# EAGLE design PulseFit-Mini (EAGLE 7.3.0)
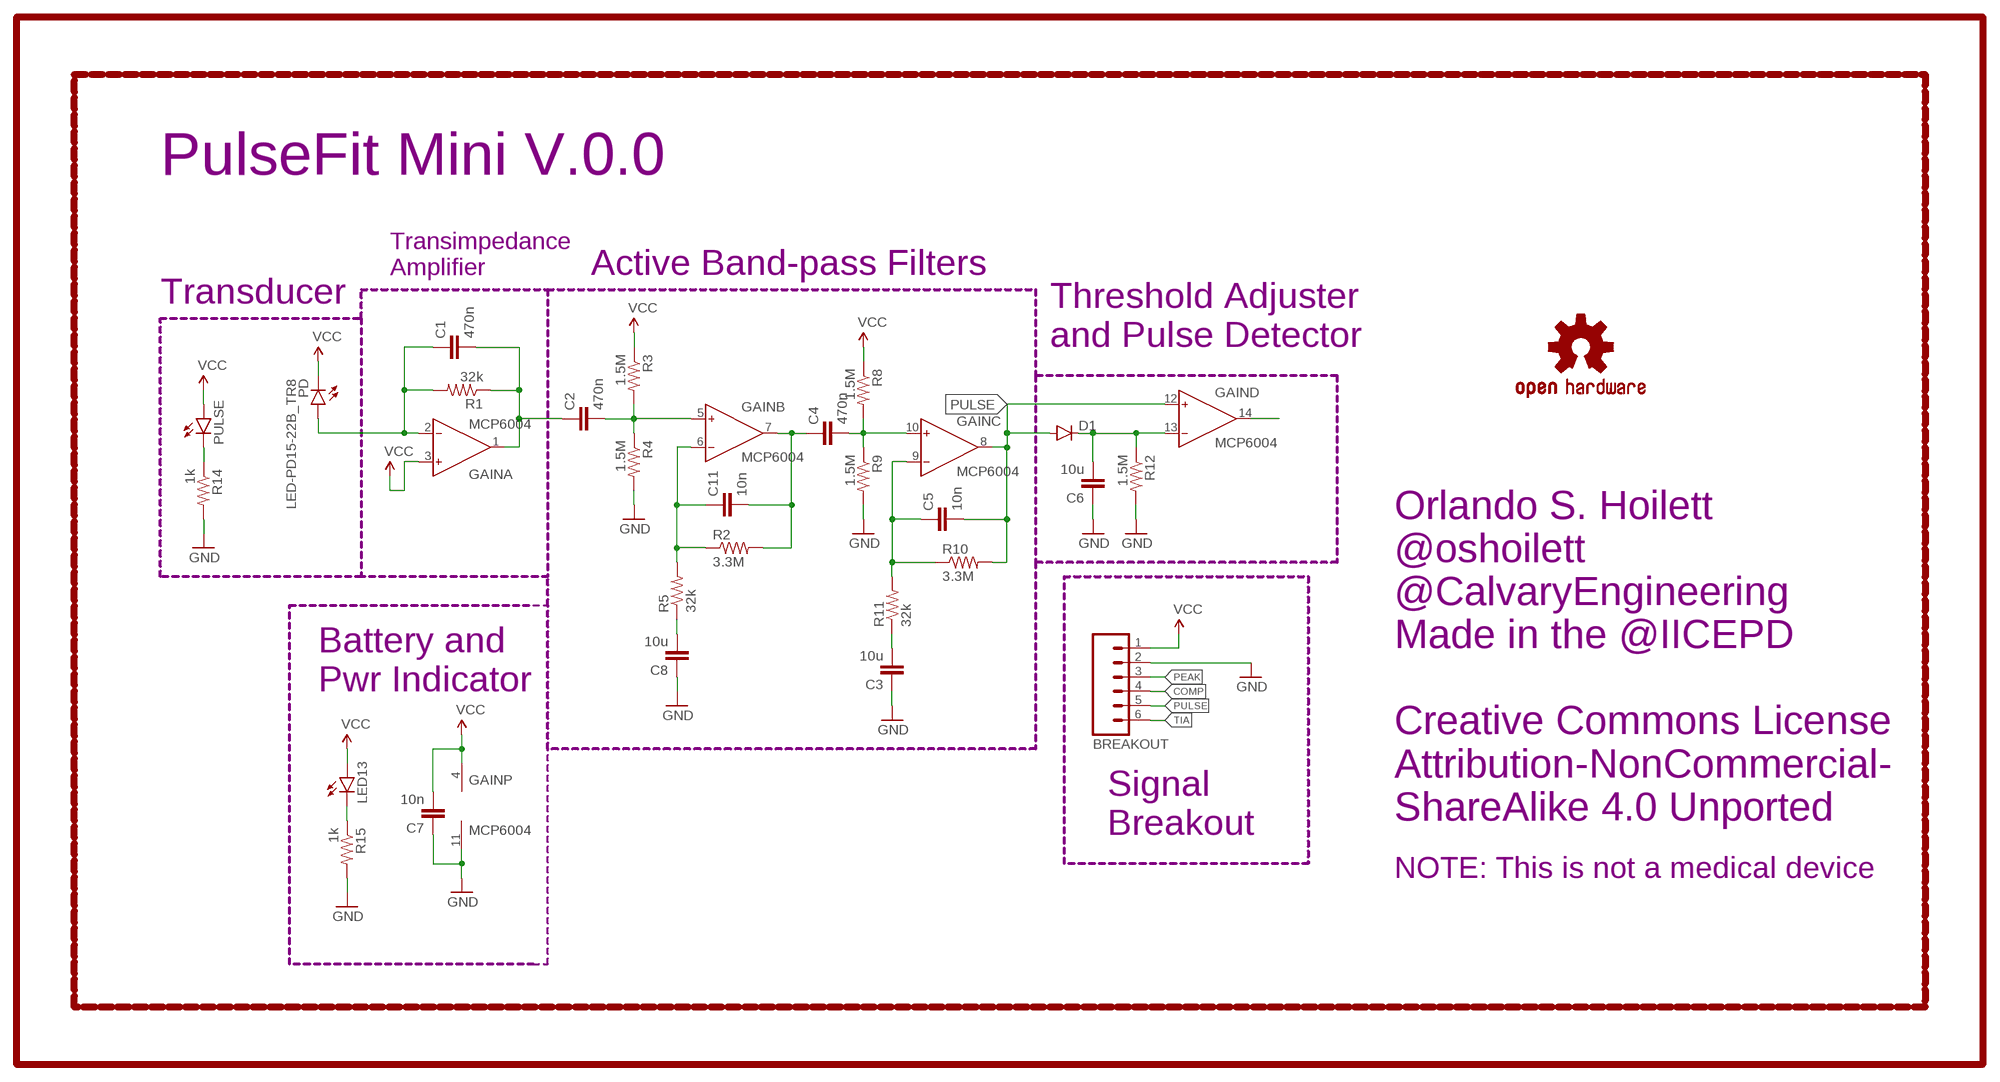
[diagram p0: schematic, sheet 1]

## Parts
BREAKOUT  M06NO_SILK_FEMALE_PTH  [1X06_NO_SILK]
C1  470n  C-EUC0402  [C0402]
C2  470n  C-EUC0402  [C0402]
C3  10u  C-EUC0805  [C0805]
C4  470n  C-EUC0402  [C0402]
C5  10n  C-EUC0402  [C0402]
C6  10u  C-EUC0805  [C0805]
C7  10n  C-EUC0402  [C0402]
C8  10u  C-EUC0805  [C0805]
C11  10n  C-EUC0402  [C0402]
D1  250mA/100V  DIODEBAS16  [SOD-323]
GAIN  MCP6004  AD8609RU  [TSSOP14]
LED13  LED0603  [LED-0603]
LOGO1  OSHW-LOGOS  [OSHW-LOGO-S]
PD  LED-PD15-22B_TR8  [LED-PD15-22B_TR8]
PULSE  LED0603  [LED-0603]
R1  32k  R-US_R0402  [R0402]
R2  3.3M  R-US_R0402  [R0402]
R3  1.5M  R-US_R0402  [R0402]
R4  1.5M  R-US_R0402  [R0402]
R5  32k  R-US_R0402  [R0402]
R8  1.5M  R-US_R0402  [R0402]
R9  1.5M  R-US_R0402  [R0402]
R10  3.3M  R-US_R0402  [R0402]
R11  32k  R-US_R0402  [R0402]
R12  1.5M  R-US_R0402  [R0402]
R14  1k  R-US_R0402  [R0402]
R15  1k  R-US_R0402  [R0402]

## Nets
COMP: BREAKOUT.4 GAIN.14(D:OUT)
GND: BREAKOUT.2 C3.1 C6.1 C7.1 C8.1 GAIN.11(P:V-) R4.2 R9.2 R12.2 R14.2 R15.2
N$1: C1.1 GAIN.2(A:IN-) PD.A-1(A) PD.A-2(A) R1.2
N$3: C4.2 GAIN.10(C:IN+) R8.2 R9.1
N$4: C2.2 GAIN.5(B:IN+) R3.2 R4.1
N$6: C3.2 R11.1
N$8: C5.1 GAIN.9(C:IN-) R10.1 R11.2
N$9: PULSE.C R14.1
N$10: C11.1 GAIN.6(B:IN-) R2.1 R5.2
N$11: C4.1 C11.2 GAIN.7(B:OUT) R2.2
N$12: LED13.C R15.1
N$14: C8.2 R5.1
PEAK: BREAKOUT.3 C6.2 D1.C GAIN.13(D:IN-) R12.1
PULSE: BREAKOUT.5 C5.2 D1.A GAIN.8(C:OUT) GAIN.12(D:IN+) R10.2
TIA: BREAKOUT.6 C1.2 C2.1 GAIN.1(A:OUT) R1.1
VCC: BREAKOUT.1 C7.2 GAIN.3(A:IN+) GAIN.4(P:V+) LED13.A PD.C-1(C) PD.C-2(C) PULSE.A R3.1 R8.1

## Notes on the sheet
- PulseFit Mini V.0.0
- Transimpedance
  Amplifier
- Active Band-pass Filters
- Transducer
- Threshold Adjuster
  and Pulse Detector
- Battery and
  Pwr Indicator
- Orlando S. Hoilett
  @oshoilett
  @CalvaryEngineering
  Made in the @IICEPD
  
  Creative Commons License
  Attribution-NonCommercial-
  ShareAlike 4.0 Unported
- Signal
  Breakout
- NOTE: This is not a medical device

## Library data of the parts
BREAKOUT = SparkFun-Connectors:M06: Header 6 Standard 6-pin 0.1" header. Use with straight break away headers (SKU : PRT-00116), right angle break away headers (PRT-00553), swiss pins (PRT-00743), machine pins (PRT-00117), and female headers (PRT-00115). Molex polarized connector foot print use with SKU : PRT-08094 with associated crimp pins and housings. NOTES ON THE VARIANTS LOCK and LOCK_LONGPADS... This footprint was designed to help hold the alignment of a through-hole component (i.e. 6-pin header) while soldering it into place. You may notice that each hole has been shifted either up or down by 0.005 of an inch from it's more standard position (which is a perfectly straight line). This slight alteration caused the pins (the squares in the middle) to touch the edges of the holes. Because they are alternating, it causes a "brace" to hold the component in place. 0.005 has proven to be the perfect amount of "off-center" position when using our standard breakaway headers. Although looks a little odd when you look at the bare footprint, once you have a header in there, the alteration is very hard to notice. Also,if you push a header all the way into place, it is covered up entirely on the bottom side. This idea of altering the position of holes to aid alignment will be further integrated into the Sparkfun Library for other footprints. It can help hold any component with 3 or more connection pins.; PROD_ID: CONN-08437
C1-C8 C11 = resistor:C-EU: CAPACITOR, European symbol
D1 = SparkFun-DiscreteSemi:DIODE: Diode These are standard reverse protection diodes and small signal diodes. SMA package can handle up to about 1A. SOD-323 can handle about 200mA. What the SOD-323 package when ordering, there are some mfgs out there that are 5-pin packages.; PROD_ID: DIO-09646
GAIN = analog-devices:AD8609: Precision Micropower, Low Noise CMOS, Rail-to-Rail Input/Output Operational Amplifiers Source: http://www.analog.com/static/imported-files/data_sheets/AD8603_8607_8609.pdf; MF: ALTERA CORPORATION; MPN: AD8609ARUZ; OC_FARNELL: 1464994; OC_NEWARK: 59K6934
LED13 PULSE = SparkFun-LED:LED: LEDs Standard schematic elements and footprints for 5mm, 3mm, 1206, and 0603 sized LEDs. 5mm - Spark Fun Electronics SKU : COM-00529 (and others)
LOGO1 = SparkFun-Aesthetics:OSHW-LOGO: Open Source Hardware Logo This logo indicates the piece of hardware it is found on incorporates a OSHW license and/or adheres to the definition of open source hardware found here: http://freedomdefined.org/OSHW
PD = Orlando:LED-PD15-22B_TR8
R1-R5 R8-R12 R14 R15 = resistor:R-US_: RESISTOR, American symbol

## Board
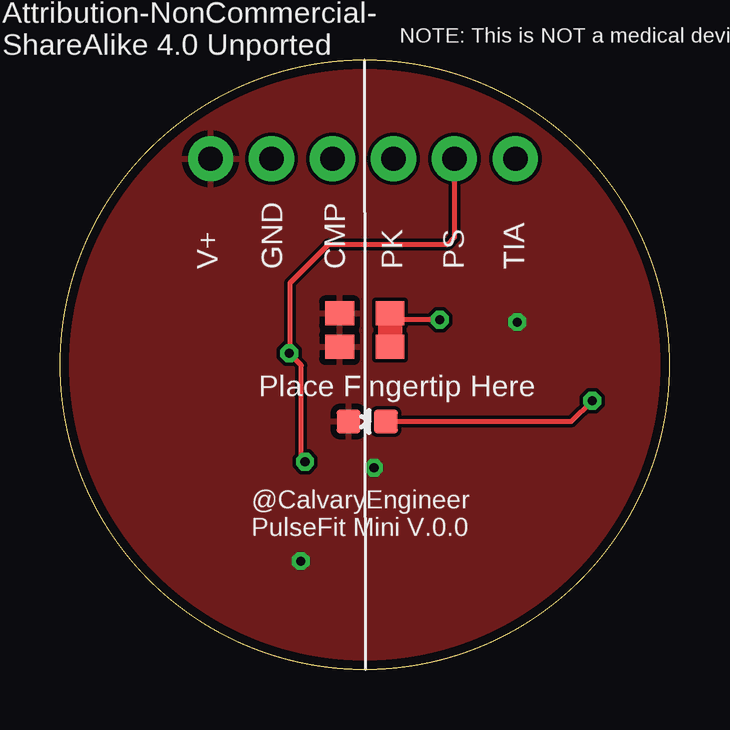
[diagram p1: board, top side]
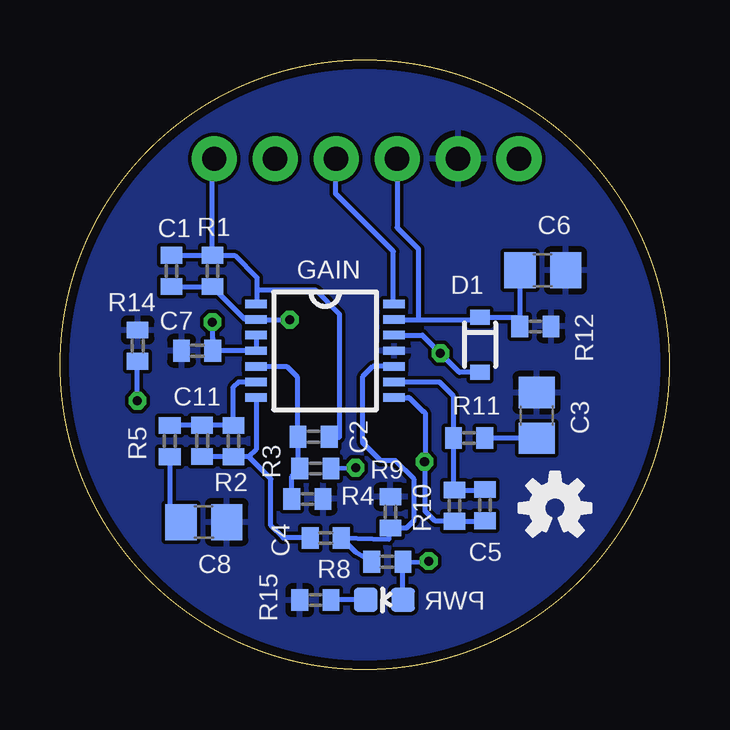
[diagram p2: board, bottom side, seen from below]

Size 25.4 x 25.4 mm. Coordinates in mm from the lower left corner, seen from the top.
Outline: circle at 12.7,12.7 radius 12.7
Copper layers (1*16): Top 0.0356mm / dielectric 1.5011mm / Bottom 0.0356mm
Design rules "LaenPCBOrder": minimum track width 6mil, minimum drill 13mil, track to track 6mil, track to pad 6mil, pad to pad 6mil, via to via 6mil, smd to smd 6mil, copper to edge 15mil, drill to drill 6mil, minimum pad ring 7mil, minimum via ring 7mil, stop-mask expansion 3mil, vias tented up to drill 0mil, thermal gap 10mil

### Footprints (pad centres in the part's own frame; a part is rotated, then mirrored left to right if it is on the bottom)
1X06_NO_SILK = drill 1.016 pad 1.88: 1 0,0; 2 2.54,0; 3 5.08,0; 4 7.62,0; 5 10.16,0; 6 12.7,0
C0402 = smd 0.7 x 0.9: 1 -0.65,0; 2 0.65,0
C0805 = smd 1.3 x 1.5: 1 -0.95,0; 2 0.95,0
SOD-323 = smd 0.63 x 0.83: A 1.15,0; C -1.15,0
TSSOP14 = smd 0.9 x 0.35: 1 -2.875,1.95; 2 -2.875,1.3; 3 -2.875,0.65; 4 -2.875,0; 5 -2.875,-0.65; 6 -2.875,-1.3; 7 -2.875,-1.95; 8 2.875,-1.95; 9 2.875,-1.3; 10 2.875,-0.65; 11 2.875,0; 12 2.875,0.65; 13 2.875,1.3; 14 2.875,1.95
LED-0603 = smd 1 x 1: A 0,-0.677; C 0,0.877
LED-PD15-22B_TR8 = smd 1.2 x 1: A-1 -1.05,0.7; A-2 -1.05,-0.7; C-1 1.05,0.7; C-2 1.05,-0.7
R0402 = smd 0.7 x 0.9: 1 -0.65,0; 2 0.65,0

### Placement (x,y rotation side)
BREAKOUT  6.27,21.29 0 top
C1  20.75,16.61 90 bottom
C2  14.83,9.7 180 bottom
C3  5.54,10.59 270 bottom
C4  14.33,5.49 0 bottom
C5  7.7,6.86 270 bottom
C6  5.28,16.64 180 bottom
C7  19.68,13.28 0 bottom
C8  19.41,6.15 180 bottom
C11  19.48,9.53 270 bottom
D1  7.9,13.54 270 bottom
GAIN  14.35,13.28 0 bottom
LED13  11.79,2.91 90 bottom
LOGO1  4.78,6.73 0 bottom
PD  12.7,14.15 180 top
PULSE  12.7,10.34 270 top
R1  19.05,16.61 270 bottom
R2  18.17,9.52 270 bottom
R3  14.76,8.38 180 bottom
R4  15.09,7.11 0 bottom
R5  20.83,9.52 90 bottom
R8  11.76,4.5 180 bottom
R9  11.63,6.55 90 bottom
R10  8.97,6.83 270 bottom
R11  8.36,9.65 180 bottom
R12  5.59,14.3 0 bottom
R14  22.16,13.5 90 bottom
R15  14.76,2.9 180 bottom

### Tracks (layer width: path | path; a pad name or v marks a point on that pad's centre or on a via)
COMP
  Bottom 0.203: GAIN.14 11.51,15.27 11.51,17.43 13.92,19.84 13.92,21.26 BREAKOUT.4
GND
  pour Bottom: -0.13,26.39 26.9,26.39 26.9,-0.69 -0.13,-0.69 -0.13,26.29
N$1  (via drill 0.38)
  Top 0.203: v15.82,14.58 14.02,14.58 PD.A-2
  Top 1.016: PD.A-2 PD.A-1
  Bottom 0.203: 19.15,15.86 R1.2 | C1.1 R1.2 | R1.2 17.67,14.58 GAIN.2 16.08,14.58 v15.82,14.58
N$3
  Bottom 0.203: R8.2 13.07,4.88 C4.2 11.69,5.44 R9.1 11.62,5.89 10.97,5.89 10.64,6.22 10.64,7.92 11.43,8.71 12.04,8.71 12.78,9.45 12.78,12.22 12.36,12.63 GAIN.10
N$4
  Bottom 0.203: GAIN.5 15.96,12.63 15.52,12.19 15.52,9.74 C2.2 15.48,8.46 R3.2 15.74,8.05 R4.1
N$6
  Bottom 0.203: R11.1 C3.2
N$8
  Bottom 0.203: R10.1 7.72,7.48 C5.1 | GAIN.9 9.6,11.98 9.02,11.4 9.02,9.66 R11.2 9.01,7.52 R10.1 | 9.02,7.53 R10.1
N$9  (via drill 0.38)
  Top 0.203: PULSE.C 21.31,10.34 v22.17,11.2
  Bottom 0.203: v22.17,11.2 22.17,12.84 R14.1
N$10
  Bottom 0.203: GAIN.6 17.96,11.99 18.17,11.77 R2.1 C11.1 | C11.1 | C11.1 R5.2
N$11
  Bottom 0.203: GAIN.7 17.23,9.16 17.53,8.86 | 17.53,8.86 18.16,8.86 R2.2 C11.2 | C4.1 16.1,5.49 16.61,5.99 16.61,7.95 17.53,8.86
N$12
  Bottom 0.203: LED13.C 14.09,2.91 R15.1
N$14
  Bottom 0.203: R5.1 20.83,6.62 C8.2
PEAK
  Bottom 0.203: GAIN.13 10.44,14.58 | 10.44,14.58 8,14.58 D1.C 6.23,14.69 | R12.1 6.23,14.69 | 6.23,14.69 C6.2 | BREAKOUT.3 11.35,18.41 10.46,17.53 10.46,14.61 10.44,14.58
PULSE  (via drill 0.38)
  Top 0.203: v10.21,8.66 10.06,8.81 10.06,12.67 v9.55,13.18 9.58,13.21 9.58,16.1 11.18,17.7 16.13,17.7 16.43,18.01 BREAKOUT.5
  Bottom 0.203: 10.93,11.33 GAIN.8 10.85,11.33 10.26,10.74 10.24,10.74 10.18,10.69 10.18,8.69 v10.21,8.66 10.18,8.64 10.18,6.6 9.76,6.18 R10.2 7.72,6.18 C5.2 | D1.A 8.76,12.39 v9.55,13.18 10.3,13.93 GAIN.12
TIA
  Bottom 0.203: R1.1 18.12,17.26 17.2,16.33 17.2,15.75 | 17.2,15.75 17.2,15.26 GAIN.1 | C1.2 R1.1 | C2.1 13.77,9.67 13.77,14.83 14.73,15.8 17.14,15.8 17.2,15.75 | R1.1 19.05,21.21 BREAKOUT.6
VCC  (via drill 0.38)
  Bottom 0.203: v10.03,4.52 10.08,4.47 R8.1 LED13.A | GAIN.3 GAIN.4 C7.2 19.04,13.8 v19.05,14.48 | R3.1 v13.08,8.41
  pour Top: -0.71,26.39 27,26.39 27,0.03 -0.81,0.03 -0.81,26.39

### Text on the board
tNames: V+ | GND | CMP | PK | PS | TIA | @CalvaryEngineer / PulseFit Mini V.0.0
bNames: PWR
tplace-old: NOTE: This is NOT a medical device | Creative Commons License / Attribution-NonCommercial- / ShareAlike 4.0 Unported | (mm)
_tsilk: Place Fingertip Here